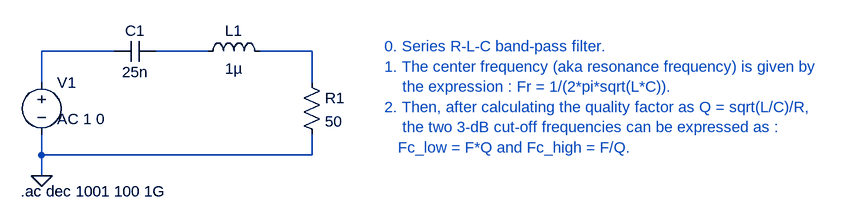
[diagram p0: schematic __BPF_RLC.asc]
__BPF_RLC.asc, the LTspice schematic file:
Version 4
SHEET 1 1280 680
WIRE 128 80 16 80
WIRE 272 80 192 80
WIRE 432 80 352 80
WIRE 16 128 16 80
WIRE 432 128 432 80
WIRE 16 240 16 208
WIRE 432 240 432 208
WIRE 432 240 16 240
WIRE 16 272 16 240
FLAG 16 272 0
SYMBOL voltage 16 112 R0
WINDOW 3 24 100 Invisible 2
WINDOW 123 24 72 Left 2
WINDOW 39 0 0 Left 2
SYMATTR Value 0
SYMATTR Value2 AC 1 0
SYMATTR InstName V1
SYMBOL cap 192 64 R90
WINDOW 0 0 32 VBottom 2
WINDOW 3 32 32 VTop 2
SYMATTR InstName C1
SYMATTR Value 25n
SYMBOL ind 256 96 R270
WINDOW 0 32 56 VTop 2
WINDOW 3 5 56 VBottom 2
SYMATTR InstName L1
SYMATTR Value 1µ
SYMBOL res 416 112 R0
SYMATTR InstName R1
SYMATTR Value 50
TEXT -16 296 Left 2 !.ac dec 1001 100 1G
TEXT 544 72 Left 2 ;0. Series R-L-C band-pass filter.\n1. The center frequency (aka resonance frequency) is given by\n    the expression : Fr = 1/(2*pi*sqrt(L*C)).\n2. Then, after calculating the quality factor as Q = sqrt(L/C)/R,\n    the two 3-dB cut-off frequencies can be expressed as :\n   Fc_low = F*Q and Fc_high = F/Q.

The netlist it stands for:
* __BPF_RLC.asc
V1 N001 0 0 AC 1 0
C1 N002 N001 25n
L1 N002 N003 1µ
R1 N003 0 50
.ac dec 1001 100 1G
* 0. Series R-L-C band-pass filter.
* 1. The center frequency (aka resonance frequency) is given by
*     the expression : Fr = 1/(2*pi*sqrt(L*C)).
* 2. Then, after calculating the quality factor as Q = sqrt(L/C)/R,
*     the two 3-dB cut-off frequencies can be expressed as :
*    Fc_low = F*Q and Fc_high = F/Q.
.backanno
.end